# Altium schematic sheet RightBar1_SchDoc.SchDoc
size A4
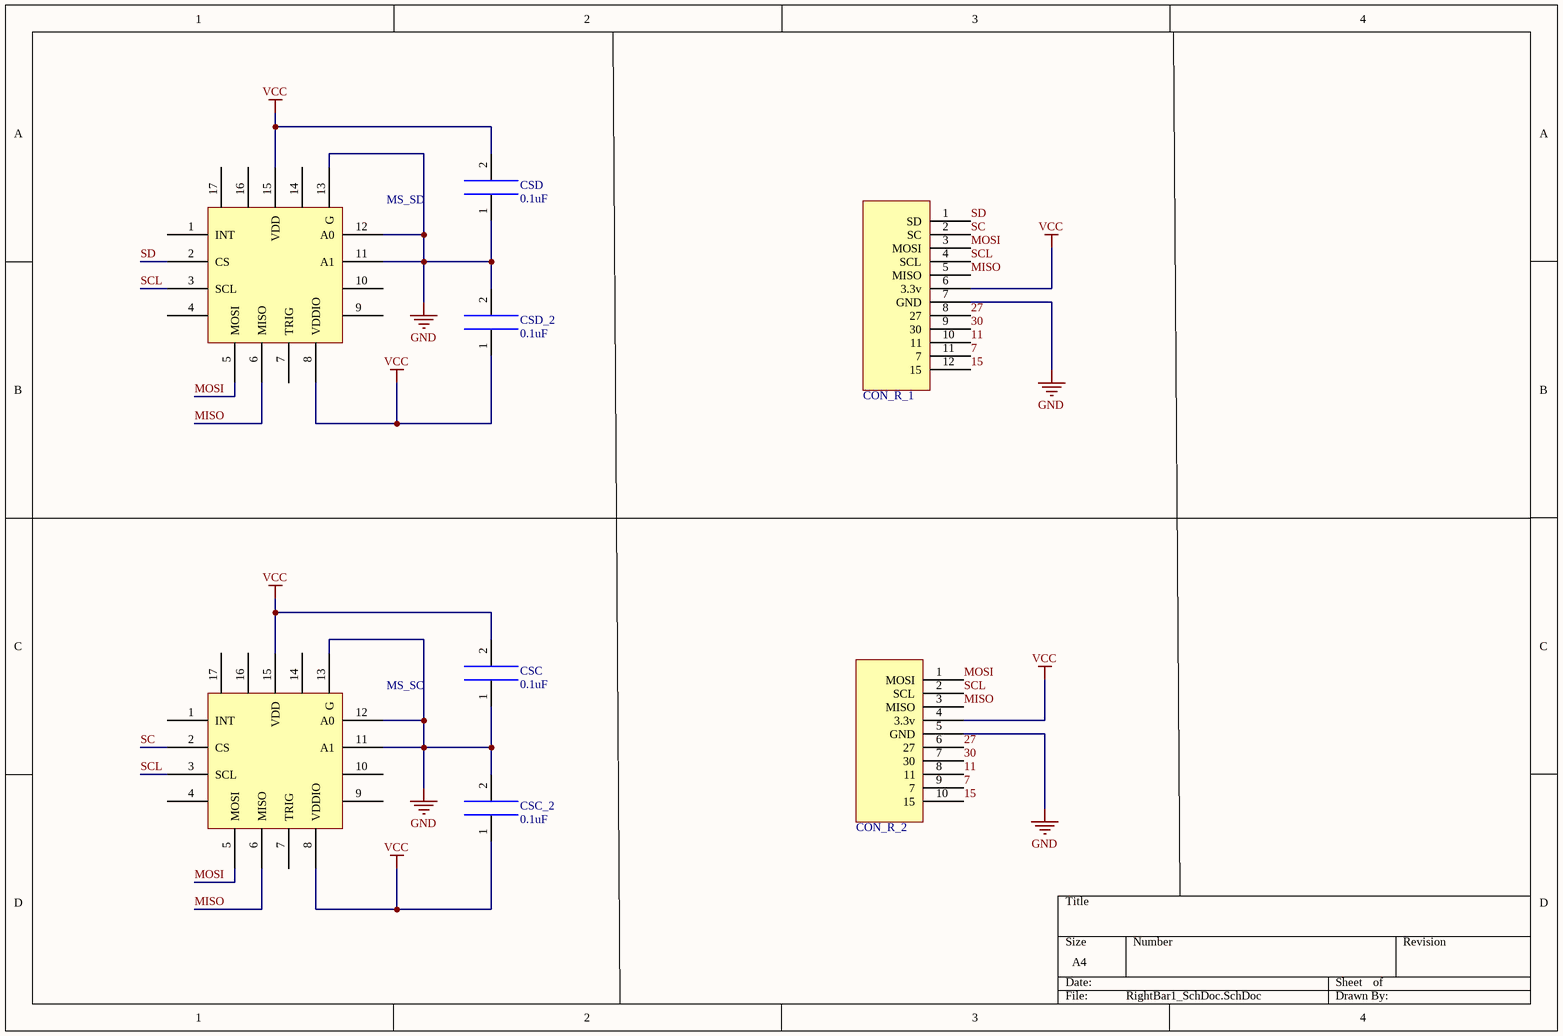
[diagram p0: RightBar1_SchDoc.SchDoc]

## Parts
CON_R_1  PIN_right  [PIN_RIGHT_1]  (value not drawn)
CON_R_2  PIN_right  [PIN_RIGHT_2]  (value not drawn)
CSC  0.1uF  [CAP_0603]
CSC_2  0.1uF  [CAP_0603]
CSD  0.1uF  [CAP_0603]
CSD_2  0.1uF  [CAP_0603]
MS_SC  MLX90393SLW ABA 011 RE  [MLX90393]  (value not drawn)
MS_SD  MLX90393SLW ABA 011 RE  [MLX90393]  (value not drawn)

## Nets
GND: CON_R_1.7(GND) CON_R_2.5(GND) CSC.1 CSC_2.2 CSD.1 CSD_2.2 MS_SC.11(A1) MS_SC.12(A0) MS_SC.13(G) MS_SD.11(A1) MS_SD.12(A0) MS_SD.13(G)
VCC: CON_R_1.6(3.3v) CON_R_2.4(3.3v) CSC.2 CSC_2.1 CSD.2 CSD_2.1 MS_SC.8(VDDIO) MS_SC.15(VDD) MS_SD.8(VDDIO) MS_SD.15(VDD)
7: CON_R_1.11(7) CON_R_2.9(7)
11: CON_R_1.10(11) CON_R_2.8(11)
15: CON_R_1.12(15) CON_R_2.10(15)
27: CON_R_1.8(27) CON_R_2.6(27)
30: CON_R_1.9(30) CON_R_2.7(30)
MISO: CON_R_1.5(MISO) CON_R_2.3(MISO) MS_SC.6(MISO) MS_SD.6(MISO)
MOSI: CON_R_1.3(MOSI) CON_R_2.1(MOSI) MS_SC.5(MOSI) MS_SD.5(MOSI)
SC: CON_R_1.2(SC) MS_SC.2(CS)
SCL: CON_R_1.4(SCL) CON_R_2.2(SCL) MS_SC.3(SCL) MS_SD.3(SCL)
SD: CON_R_1.1(SD) MS_SD.2(CS)

Not connected (* = marked no-connect by the designer): MS_SC 1(INT) 4 7(TRIG) 9 10 14 16 17; MS_SD 1(INT) 4 7(TRIG) 9 10 14 16 17

## Library data of the parts
CON_R_2 = PIN_right_2
CSC CSC_2 CSD CSD_2 = CAP: Capacitance
MS_SC MS_SD = MLX90393SLW ABA 011 RE: MLX90393 Sensor